# Altium schematic sheet LEDs.SchDoc
size A
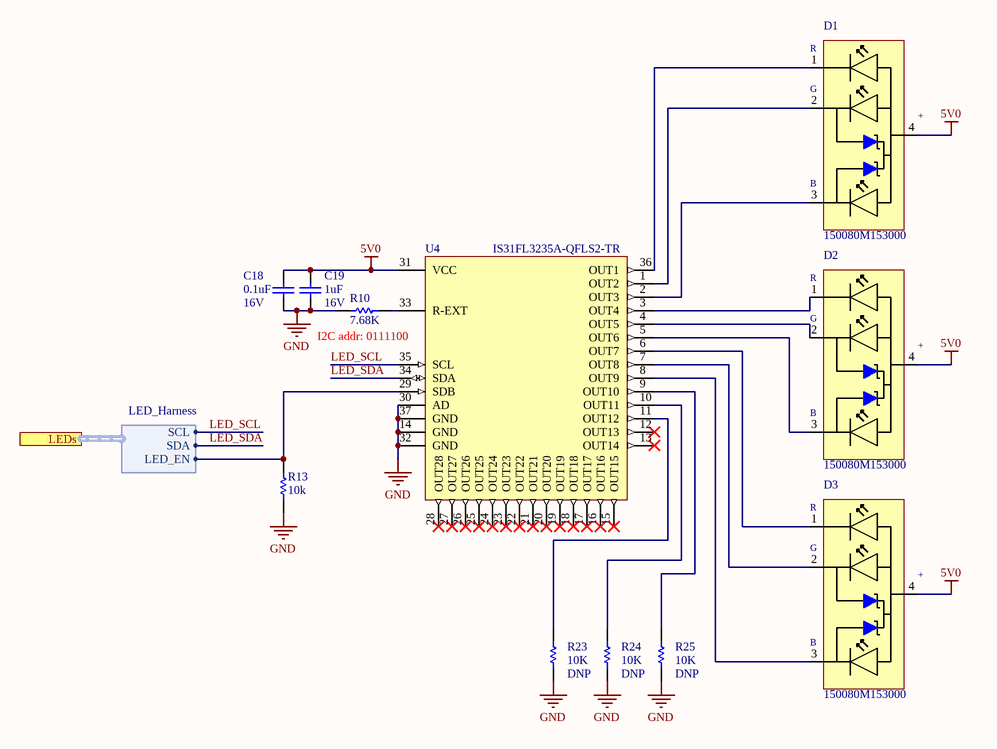
[diagram p0: LEDs.SchDoc]

## Parts
C18  0.1uF  Voltage - Rated: 16V  [CAPC1005(0402)N]
C19  1uF  Voltage - Rated: 16V  [CAPC1005(0402)N]
D1  150080M153000  [*LED_150080M153000]
D2  150080M153000  [*LED_150080M153000]
D3  150080M153000  [*LED_150080M153000]
R10  7.68K  [RESC1005(0402)N]
R13  10k  [RESC1005(0402)N]
R23  value 10K  [0402]  (hidden comment: Res1)
R24  value 10K  [0402]  (hidden comment: Res1)
R25  value 10K  [0402]  (hidden comment: Res1)
U4  IS31FL3235A-QFLS2-TR  [QFN40P400X400X80_HS-37N]

## Ports
LEDs (harness LED_Harness)

## Harnesses
LED_Harness: SDA, SCL, LED_EN

## Nets
5V0: C18.2 C19.2 D1.4(A) D2.4(A) D3.4(A) U4.31(VCC)
GND: C18.1 C19.1 R10.1 R13.1 R23.1 R24.1 R25.1 U4.14(GND) U4.30(AD) U4.32(GND) U4.37(GND)
LED_SCL: U4.35(SCL) ; port LEDs.SCL
LED_SDA: U4.34(SDA) ; port LEDs.SDA
NetD1_1: D1.1(R) U4.36(OUT1)
NetD1_2: D1.2(G) U4.1(OUT2)
NetD1_3: D1.3(B) U4.2(OUT3)
NetD2_1: D2.1(R) U4.3(OUT4)
NetD2_2: D2.2(G) U4.4(OUT5)
NetD2_3: D2.3(B) U4.5(OUT6)
NetD3_1: D3.1(R) U4.6(OUT7)
NetD3_2: D3.2(G) U4.7(OUT8)
NetD3_3: D3.3(B) U4.8(OUT9)
NetR10_2: R10.2 U4.33(R-EXT)
NetR13_2: R13.2 U4.29(SDB) ; port LEDs.LED_EN
NetR23_2: R23.2 U4.11(OUT12)
NetR24_2: R24.2 U4.10(OUT11)
NetR25_2: R25.2 U4.9(OUT10)

Not connected (* = marked no-connect by the designer): U4 12(OUT13)* 13(OUT14)* 15(OUT15)* 16(OUT16)* 17(OUT17)* 18(OUT18)* 19(OUT19)* 20(OUT20)* 21(OUT21)* 22(OUT22)* 23(OUT23)* 24(OUT24)* 25(OUT25)* 26(OUT26)* 27(OUT27)* 28(OUT28)*

## Notes on the sheet
- (near U4) I2C addr: 0111100
- (in symbol 150080M153000) +

## Library data of the parts
C18 = CAP: CAP CER 0.1UF 16V X5R 0402; Manufacturer 1: Murata; Manufacturer Part Number 1: GRM155R61C104KA88D; Tolerance: ±10%; Level: 1; Vendor PN: 490-5415-1-ND; Temperature Coefficient: X5R; RoHS: RoHS Compliant; Category: Capacitors; Capacitance: 0.1uF; Mounting Type: Surface Mount, MLCC; Operating Temperature: -55°C ~ 85°C; Package / Case: 0402 (1005 Metric); Size / Dimension: 0.039" L x 0.020" W (1.00mm x 0.50mm); Thickness (Max): 0.022" (0.55mm)
C19 = CAP: Manufacturer 1: Samsung; Manufacturer Part Number 1: CL05A105KO5NNNC; Temperature Coefficient: X5R; Tolerance: ±10%; Level: 1; Vendor PN: 1276-1067-1-ND; RoHS: RoHS Compliant; Category: Capacitors; Capacitance: 1uF; Mounting Type: Surface Mount, MLCC; Operating Temperature: -55°C ~ 85°C; Package / Case: 0402 (1005 Metric); Size / Dimension: 0.039" L x 0.020" W (1.00mm x 0.50mm); Thickness (Max): 0.022" (0.55mm)
D1-D3 = 150080M153000: Red, Green, Blue _RGB_ 624nm Red, 525nm Green, 470nm Blue LED Indication - Discrete 2V Red, 3.3V Green, 3.3V Blue 4-SMD, No Lead; MF: Wurth Electronics; Vendor PN: 732-11392-1-ND; SnapEDA_Link: https://www.snapeda.com/parts/150080M153000/Wurth%20Electronics%20Inc./view-part/2747771/?ref=snap; Availability: Unavailable; Price: None; MP: 150080M153000; Package: SMD-4 WÃ¼rth Elektronik; Value: *
R10 = RES: Resistor, Chip; Manufacturer 1: Stackpole; Manufacturer Part Number 1: RMCF0402FT7K68; Level: 1; Vendor PN: RMCF0402FT7K68CT-ND; Category: Resistors; Number of Terminations: 2; Composition: -; Power (Watts): -; Resistance: 7.68K; Temperature Coefficient: -; Tolerance: -; Package / Case: 0402 (1005 Metric)
R13 = RES: Resistor, Chip; Manufacturer 1: Stackpole; Manufacturer Part Number 1: RMCF0402FT10K0; Level: 1; Vendor PN: RMCF0402FT10K0CT-ND; Category: Resistors; Number of Terminations: 2; Composition: -; Power (Watts): -; Resistance: 10k; Temperature Coefficient: -; Tolerance: -; Package / Case: 0402 (1005 Metric); DNP: *
R23-R25 = Res1: Resistor; Vendor PN: 311-10.0KLRCT-ND; Published: 8-Jun-2000; LatestRevisionDate: 17-Jul-2002; LatestRevisionNote: Re-released for DXP Platform.; PackageReference: AXIAL-0.3; Publisher: Altium Limited; PackageDescription: Axial Device, Thru-Hole; 2 Leads; 0.3 in Pin Spacing; DNP: DNP
U4 = IS31FL3235A-QFLS2-TR: 28 channel LED Driver; Manufacturer 1: ISSI; Vendor PN: 706-1588-1-ND; Manufacturer Part Number 1: IS31FL3235A-QFLS2-TR